# EAGLE design board (EAGLE 6.4)
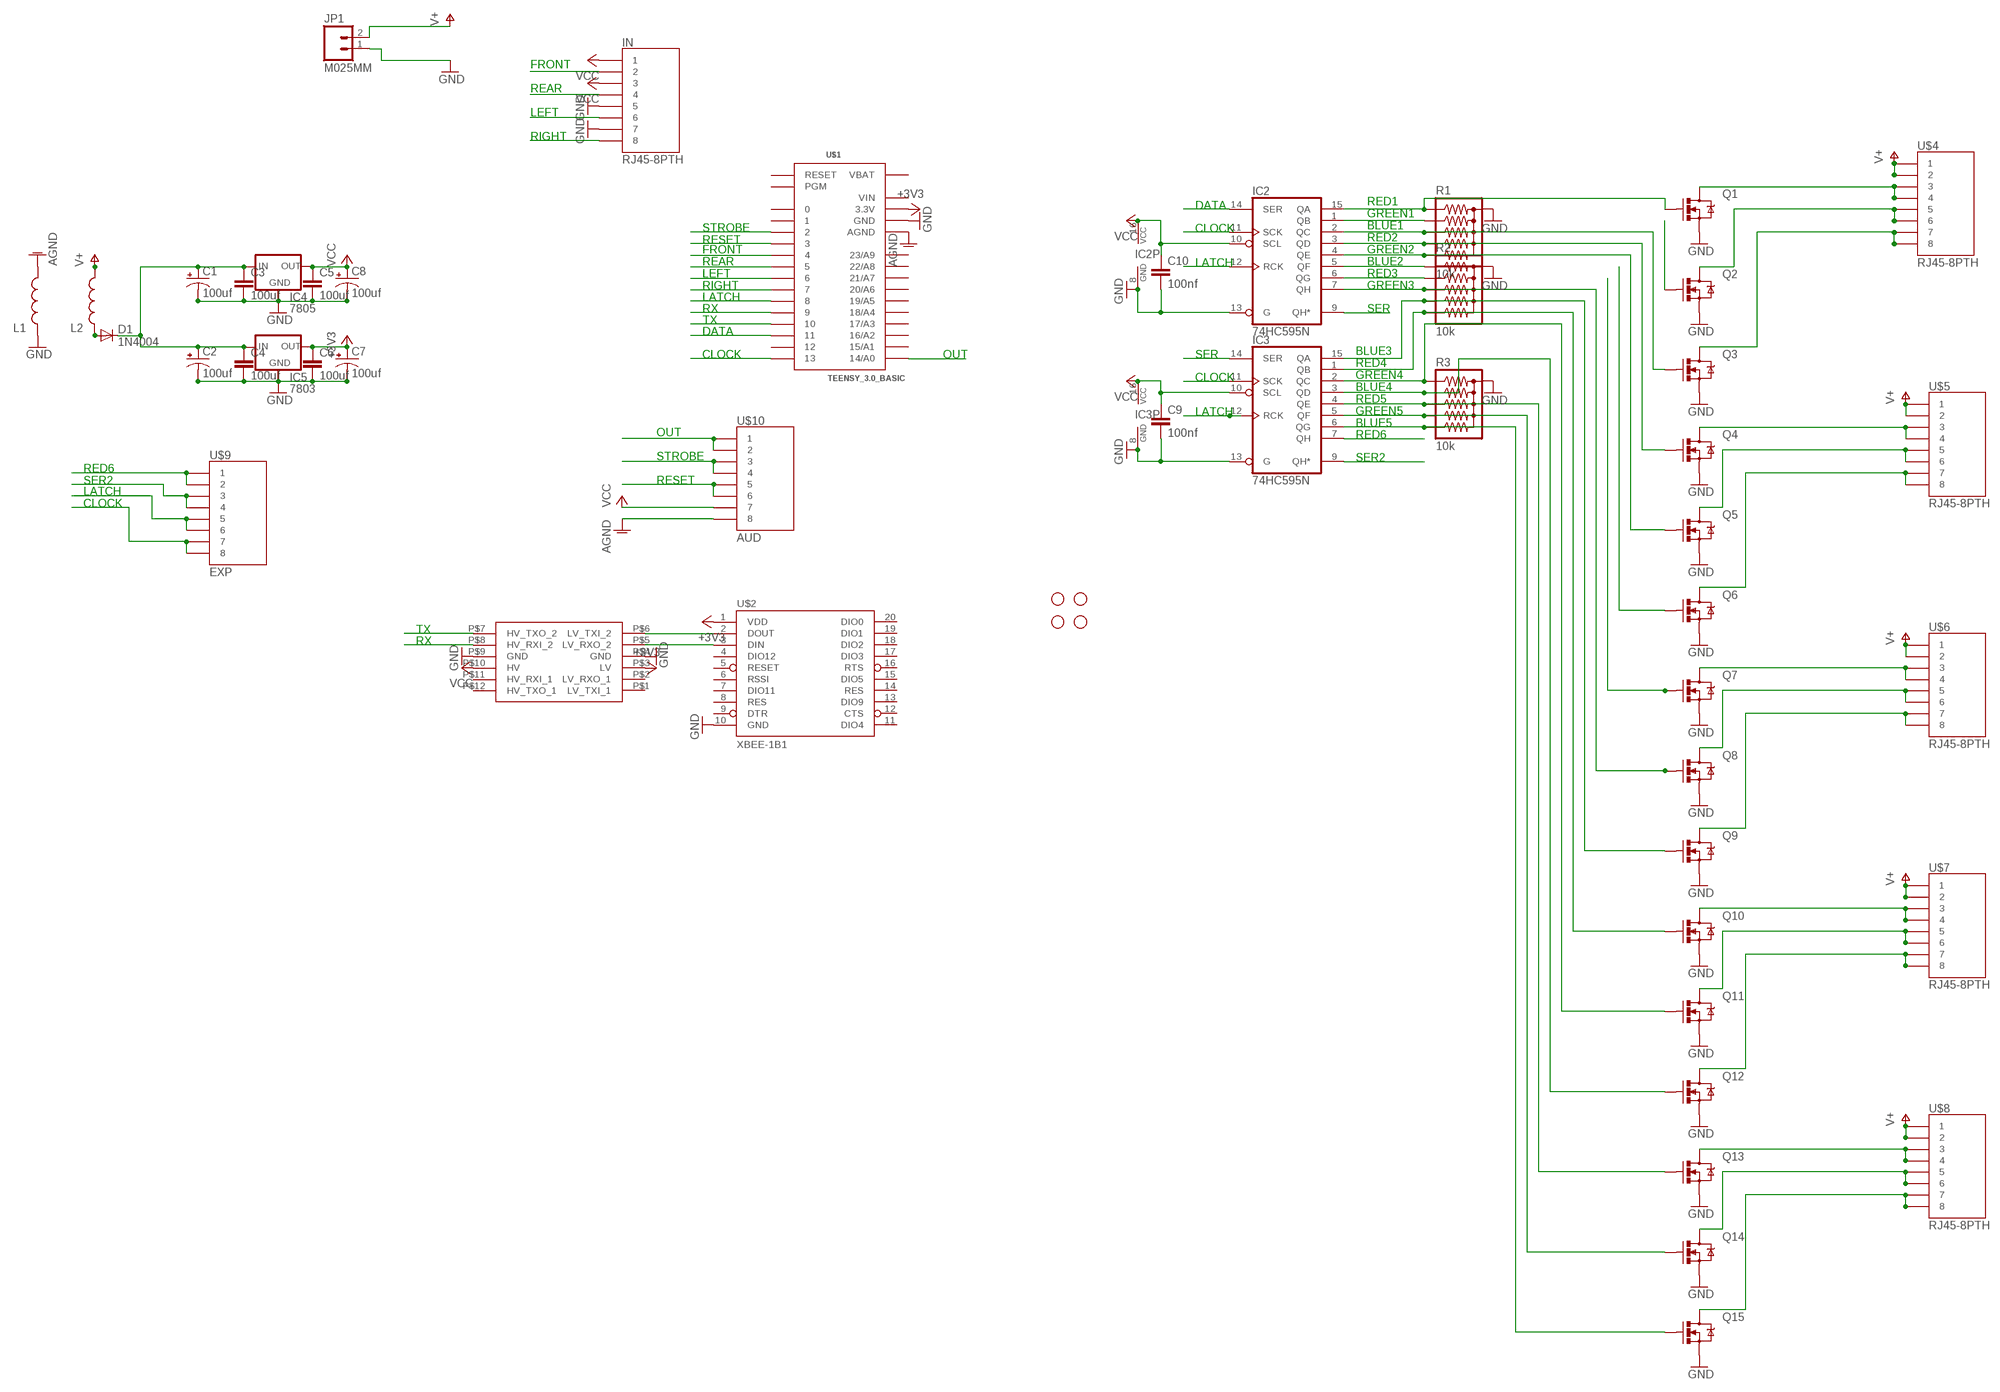
[diagram p0: schematic, sheet 1]

## Parts
C1  100uf  CAP_POLPTH1  [CPOL-RADIAL-100UF-25V]
C2  100uf  CAP_POLPTH1  [CPOL-RADIAL-100UF-25V]
C3  100uf  CAPPTH  [CAP-PTH-SMALL]
C4  100uf  CAPPTH  [CAP-PTH-SMALL]
C5  100uf  CAPPTH  [CAP-PTH-SMALL]
C6  100uf  CAPPTH  [CAP-PTH-SMALL]
C7  100uf  CAP_POLPTH1  [CPOL-RADIAL-100UF-25V]
C8  100uf  CAP_POLPTH1  [CPOL-RADIAL-100UF-25V]
C9  100nf  CAPPTH  [CAP-PTH-SMALL]
C10  100nf  CAPPTH  [CAP-PTH-SMALL]
D1  1N4004  [DO41-10]
IC2  74HC595N  [DIL16]
IC3  74HC595N  [DIL16]
IC4  7805  V_REG_78XXSINK  [TO220-IGO]
IC5  7803  V_REG_LD1117VXX  [78XXL]
IN  RJ45-8PTH  [RJ45-8]
JP1  M025MM  [SCREWTERMINAL-5MM-2]
L1  INDUCTORRLB0912  [RLB0912]
L2  INDUCTORRLB0912  [RLB0912]
Q1  MOSFET-NCHANNELFQP30N06L  [TO220V]
Q2  MOSFET-NCHANNELFQP30N06L  [TO220V]
Q3  MOSFET-NCHANNELFQP30N06L  [TO220V]
Q4  MOSFET-NCHANNELFQP30N06L  [TO220V]
Q5  MOSFET-NCHANNELFQP30N06L  [TO220V]
Q6  MOSFET-NCHANNELFQP30N06L  [TO220V]
Q7  MOSFET-NCHANNELFQP30N06L  [TO220V]
Q8  MOSFET-NCHANNELFQP30N06L  [TO220V]
Q9  MOSFET-NCHANNELFQP30N06L  [TO220V]
Q10  MOSFET-NCHANNELFQP30N06L  [TO220V]
Q11  MOSFET-NCHANNELFQP30N06L  [TO220V]
Q12  MOSFET-NCHANNELFQP30N06L  [TO220V]
Q13  MOSFET-NCHANNELFQP30N06L  [TO220V]
Q14  MOSFET-NCHANNELFQP30N06L  [TO220V]
Q15  MOSFET-NCHANNELFQP30N06L  [TO220V]
R1  10k  RPACK-BUSSED-5-SIP-PTH-5  [RPACK-SIP-PTH-5]
R2  10k  RPACK-BUSSED-5-SIP-PTH-5  [RPACK-SIP-PTH-5]
R3  10k  RPACK-BUSSED-5-SIP-PTH-5  [RPACK-SIP-PTH-5]
STANDOFF1  STAND-OFF  [STAND-OFF]
STANDOFF2  STAND-OFF  [STAND-OFF]
STANDOFF3  STAND-OFF  [STAND-OFF]
STANDOFF4  STAND-OFF  [STAND-OFF]
U$1  TEENSY_3.0_BASIC  [TEENSY_3.0_BASIC]
U$2  XBEE-1B1  [XBEE-1]
U$3  LOGIC_LEVEL_CONVERTER  [LOGIC_LEVEL_CONVERTER]
U$4  RJ45-8PTH  [RJ45-8]
U$5  RJ45-8PTH  [RJ45-8]
U$6  RJ45-8PTH  [RJ45-8]
U$7  RJ45-8PTH  [RJ45-8]
U$8  RJ45-8PTH  [RJ45-8]
U$9  EXP  RJ45-8PTH  [RJ45-8]
U$10  AUD  RJ45-8PTH  [RJ45-8]

## Nets
+3V3: C6.1 C7.1(+) IC5.GND(OUT) U$1.3.3V U$1.3.3V1(3.3V) U$2.1(VDD) U$3.P$3(LV)
AGND: L1.2 U$1.AGND U$10.8
BLUE1: IC2.2(QC) Q3.1(G) R1.P$4
BLUE2: IC2.5(QF) Q6.1(G) R2.P$2
BLUE3: IC3.15(QA) Q9.1(G) R2.P$5
BLUE4: IC3.3(QD) Q12.1(G) R3.P$3
BLUE5: IC3.6(QG) Q15.1(G) R3.P$6
CLOCK: IC2.11(SCK) IC3.11(SCK) U$1.13 U$9.7 U$9.8
DATA: IC2.14(SER) U$1.11
FRONT: IN.2 U$1.4
GND: C1.2(-) C2.2(-) C3.2 C4.2 C5.2 C6.2 C7.2(-) C8.2(-) C9.2 C10.2 IC2.8(GND) IC2.13(G) IC3.8(GND) IC3.13(G) IC4.GND IC5.IN(GND) IN.5 IN.7 JP1.1 L1.1 Q1.3(S) Q2.3(S) Q3.3(S) Q4.3(S) Q5.3(S) Q6.3(S) Q7.3(S) Q8.3(S) Q9.3(S) Q10.3(S) Q11.3(S) Q12.3(S) Q13.3(S) Q14.3(S) Q15.3(S) R1.P$1 R2.P$1 R3.P$1 U$1.GND U$1.GND1(GND) U$2.10(GND) U$3.P$4(GND) U$3.P$9(GND)
GREEN1: IC2.1(QB) Q2.1(G) R1.P$3
GREEN2: IC2.4(QE) Q5.1(G) R1.P$6
GREEN3: IC2.7(QH) Q8.1(G) R2.P$4
GREEN4: IC3.2(QC) Q11.1(G) R3.P$2
GREEN5: IC3.5(QF) Q14.1(G) R3.P$5
LATCH: IC2.12(RCK) IC3.12(RCK) U$1.8 U$9.5 U$9.6
LEFT: IN.6 U$1.6
N$1: Q3.2(D) U$4.7 U$4.8
N$3: D1.A L2.1
N$4: Q4.2(D) U$5.3 U$5.4
N$5: Q5.2(D) U$5.5 U$5.6
N$6: Q6.2(D) U$5.7 U$5.8
N$7: C1.1(+) C2.1(+) C3.1 C4.1 D1.C IC4.IN IC5.OUT(IN)
N$8: Q7.2(D) U$6.3 U$6.4
N$10: Q8.2(D) U$6.5 U$6.6
N$11: Q9.2(D) U$6.7 U$6.8
N$12: Q10.2(D) U$7.3 U$7.4
N$13: Q11.2(D) U$7.5 U$7.6
N$14: Q12.2(D) U$7.7 U$7.8
N$15: Q13.2(D) U$8.3 U$8.4
N$16: Q14.2(D) U$8.5 U$8.6
N$17: Q15.2(D) U$8.7 U$8.8
N$19: Q1.2(D) U$4.3 U$4.4
N$20: Q2.2(D) U$4.5 U$4.6
N$28: U$2.3(DIN) U$3.P$5(LV_RXO_2)
N$29: U$2.2(DOUT) U$3.P$6(LV_TXI_2)
OUT: U$1.14/A0 U$10.1 U$10.2
REAR: IN.4 U$1.5
RED1: IC2.15(QA) Q1.1(G) R1.P$2
RED2: IC2.3(QD) Q4.1(G) R1.P$5
RED3: IC2.6(QG) Q7.1(G) R2.P$3
RED4: IC3.1(QB) Q10.1(G) R2.P$6
RED5: IC3.4(QE) Q13.1(G) R3.P$4
RED6: IC3.7(QH) U$9.1 U$9.2
RESET: U$1.3 U$10.5 U$10.6
RIGHT: IN.8 U$1.7
RX: U$1.9 U$3.P$7(HV_TXO_2)
SER: IC2.9(QH*) IC3.14(SER)
SER2: IC3.9(QH*) U$9.3 U$9.4
STROBE: U$1.2 U$10.3 U$10.4
TX: U$1.10 U$3.P$8(HV_RXI_2)
V+: JP1.2 L2.2 U$4.1 U$4.2 U$5.1 U$5.2 U$6.1 U$6.2 U$7.1 U$7.2 U$8.1 U$8.2
VCC: C5.1 C8.1(+) C9.1 C10.1 IC2.10(SCL) IC2.16(VCC) IC3.10(SCL) IC3.16(VCC) IC4.OUT IN.1 IN.3 U$3.P$10(HV) U$10.7
Unconnected: U$1.0 U$1.1 U$1.12 U$1.15/A1 U$1.16/A2 U$1.17/A3 U$1.18/A4 U$1.19/A5 U$1.20/A6 U$1.21/A7 U$1.22/A8 U$1.23/A9 U$1.PGM U$1.RESET U$2.4(DIO12) U$2.5(RESET) U$2.6(RSSI) U$2.7(DIO11) U$2.8(RES) U$2.9(DTR) U$2.11(DIO4) U$2.12(CTS) U$2.13(DIO9) U$2.14(RES) U$2.15(DIO5) U$2.16(RTS) U$2.17(DIO3) U$2.18(DIO2) U$2.19(DIO1) U$2.20(DIO0) U$3.P$1(LV_TXI_1) U$3.P$2(LV_RXO_1) U$3.P$11(HV_RXI_1) U$3.P$12(HV_TXO_1)

## Notes on the sheet
- FRONT
  
  REAR
  
  LEFT
  
  RIGHT
- DATA
- CLOCK
- STROBE
  RESET
- LATCH
- FRONT
  REAR
  LEFT
  RIGHT
- RED1
  GREEN1
  BLUE1
  RED2
  GREEN2
  BLUE2
  RED3
  GREEN3
- LATCH
- RX | SER
- TX
- DATA
- CLOCK | OUT | SER
- CLOCK
- LATCH
- BLUE3
  RED4
  GREEN4
  BLUE4
  RED5
  GREEN5
  BLUE5
- RED6
- SER2
- RED6
  SER2
- OUT
  
  STROBE
  
  RESET
- LATCH
  CLOCK
- TX
- RX

## Power pins joined to a net without a drawn wire
VBAT: U$1.VBAT
VIN: U$1.VIN

## Library data of the parts
C1 C2 C7 C8 = SparkFun-Capacitors:CAP_POL: Capacitor Polarized These are standard SMD and PTH capacitors. Normally 10uF, 47uF, and 100uF in electrolytic and tantalum varieties. Always verify the external diameter of the through hole cap, it varies with capacity, voltage, and manufacturer. The EIA devices should be standard.
C3-C6 C9 C10 = SparkFun-Capacitors:CAP: Capacitor Standard 0603 ceramic capacitor, and 0.1" leaded capacitor.
D1 = diode:1N4004: DIODE general purpose rectifier, 1 A
IC2 IC3 = 74xx-eu:74*595: 8-bit SHIFT REGISTER, output latch
IC4 = SparkFun-PowerIC:V_REG_78XX: Voltage Regulator Standard 7805 5V regulator. IGO (Input Ground Output). Spark Fun Electronics SKU : COM-00107
IC5 = SparkFun-PowerIC:V_REG_LD1117VXX: LD1117VXX voltage regulator. We carry the 3.3V version (COM-00526) in TO-220 package.
IN U$4-U$10 = SparkFun-Connectors:RJ45-8: RJ45 Jack Simple RJ45, 8-pin connection - connector for common Cat5, Cat5e, and Cat6 Ethernet cables. Footprint not yet proven in production. Connector sku is PRT-00643; Breakout PCB sku is BOB-00716.
JP1 = SparkFun-Connectors:M02: Standard 2-pin 0.1" header. Use with - straight break away headers ( PRT-00116) - right angle break away headers (PRT-00553) - swiss pins (PRT-00743) - machine pins (PRT-00117) - female headers (PRT-00115) Molex polarized connector foot print use with: PRT-08233 with associated crimp pins and housings. 2.54_SCREWTERM for use with PRT-10571. 3.5mm Screw Terminal footprints for PRT-08084 5mm Screw Terminal footprints for use with PRT-08433
L1 L2 = SparkFun-Passives:INDUCTOR: Inductors Basic Inductor/Choke - 0603 and 1206. Footprints are not proven and vary greatly between part numbers. SRN6045- 33uH, 20% 1.4A SDR0403-560KL - 56uH, 10%, 500mA RMS/740mA peak
Q1-Q15 = SparkFun-DiscreteSemi:MOSFET-NCHANNEL: Common NMOSFET Parts MFG P/N Store ID Prod ID FDD8780 TRANS-09984 SI7820DN TRANS-11055 FDS6630A IC-08089 2N7002PW TRANS-11151 FQP30N06L COM-10213 TRANS-10060 BSS123LT1G TRANS-08345 BSS138 TRANS-00830 BS170 2N7000; PROD_ID: TRANS-10060
R1-R3 = SparkFun-Resistors:RPACK-BUSSED-5: BOURNS 4600X series thick-film SIP resistor packs Five resistors bussed to a single pin (denoted by dot). 0.2W / resistor datasheet <http://dlnmh9ip6v2uc.cloudfront.net/datasheets/Components/General/4600x.pdf> SFE parts COM-10855 (330), COM-10856 (10K)
STANDOFF1-STANDOFF4 = SparkFun-Electromechanical:STAND-OFF: #4 Stand Off This is the mechanical footprint for a #4 phillips button head screw. Use the keepout ring to avoid running the screw head into surrounding components. SKU : PRT-00447
U$1 = Teensy3.0:TEENSY_3.0_BASIC: Basic Teensy 3.0 with none of the 'inner' pins enabled. See '+4', 'AllAnalogPins", and 'AllPins' packages for additional pin holes, as needed.
U$2 = SparkFun-RF:XBEE-1: Xbee module footprints SMT header is CONN-09042.
U$3 = SparkFun-Boards:LOGIC_LEVEL_CONVERTER: Logic Level Converter (3.3v - 5v) https://www.sparkfun.com/products/8745

## Board
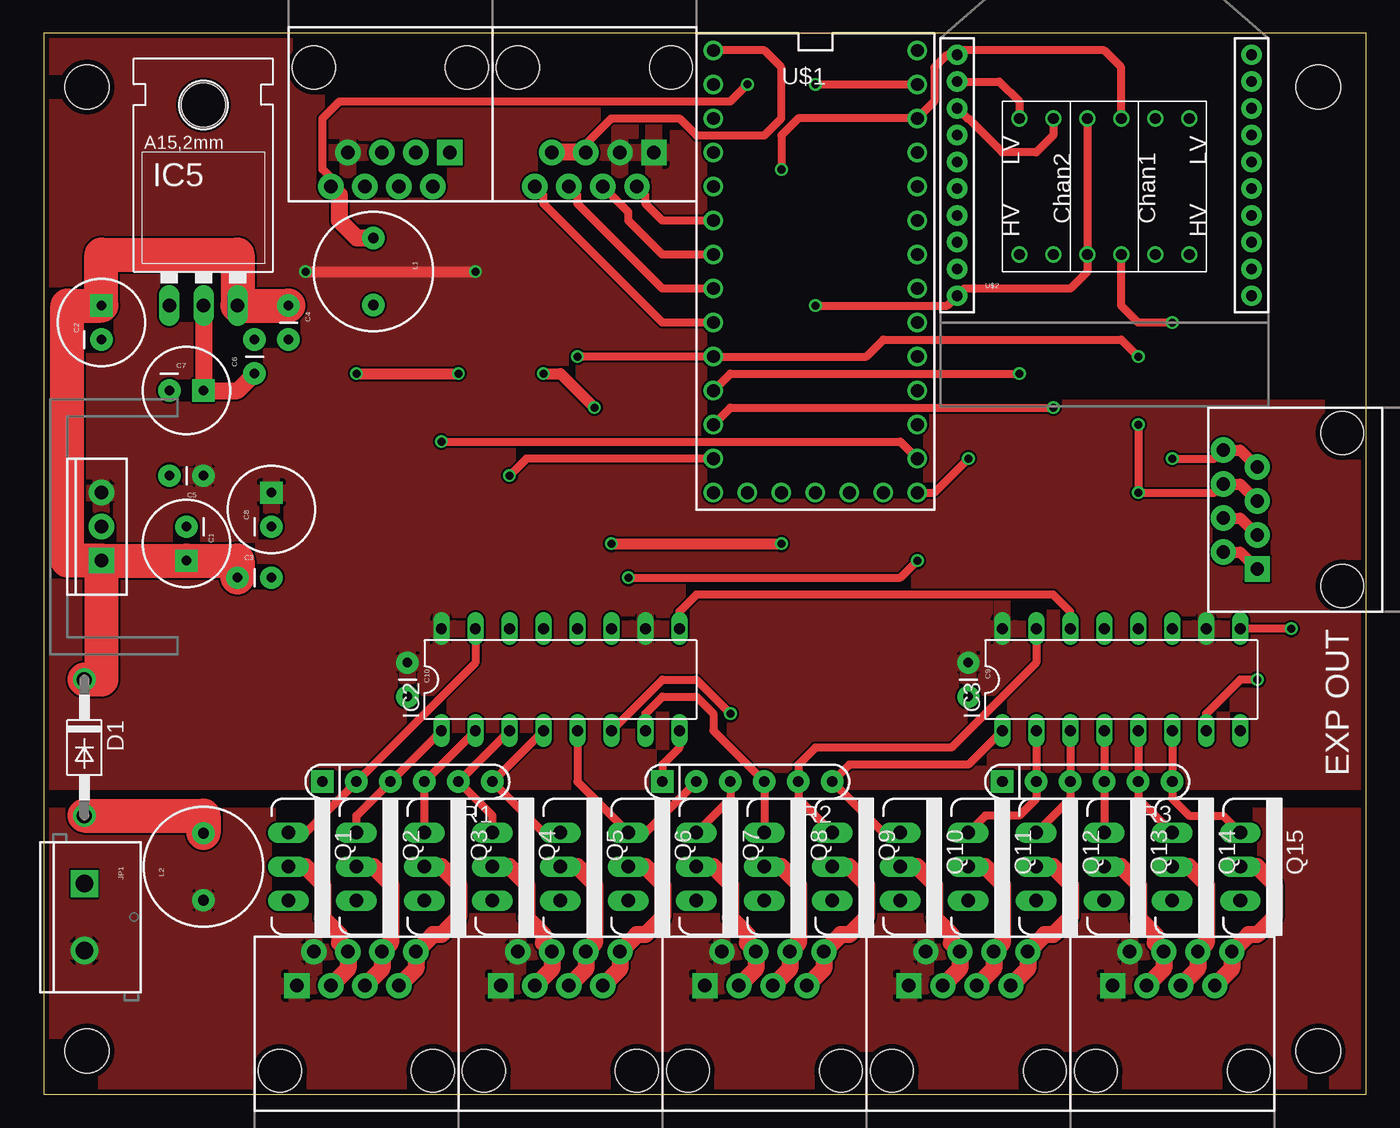
[diagram p1: board, top side]
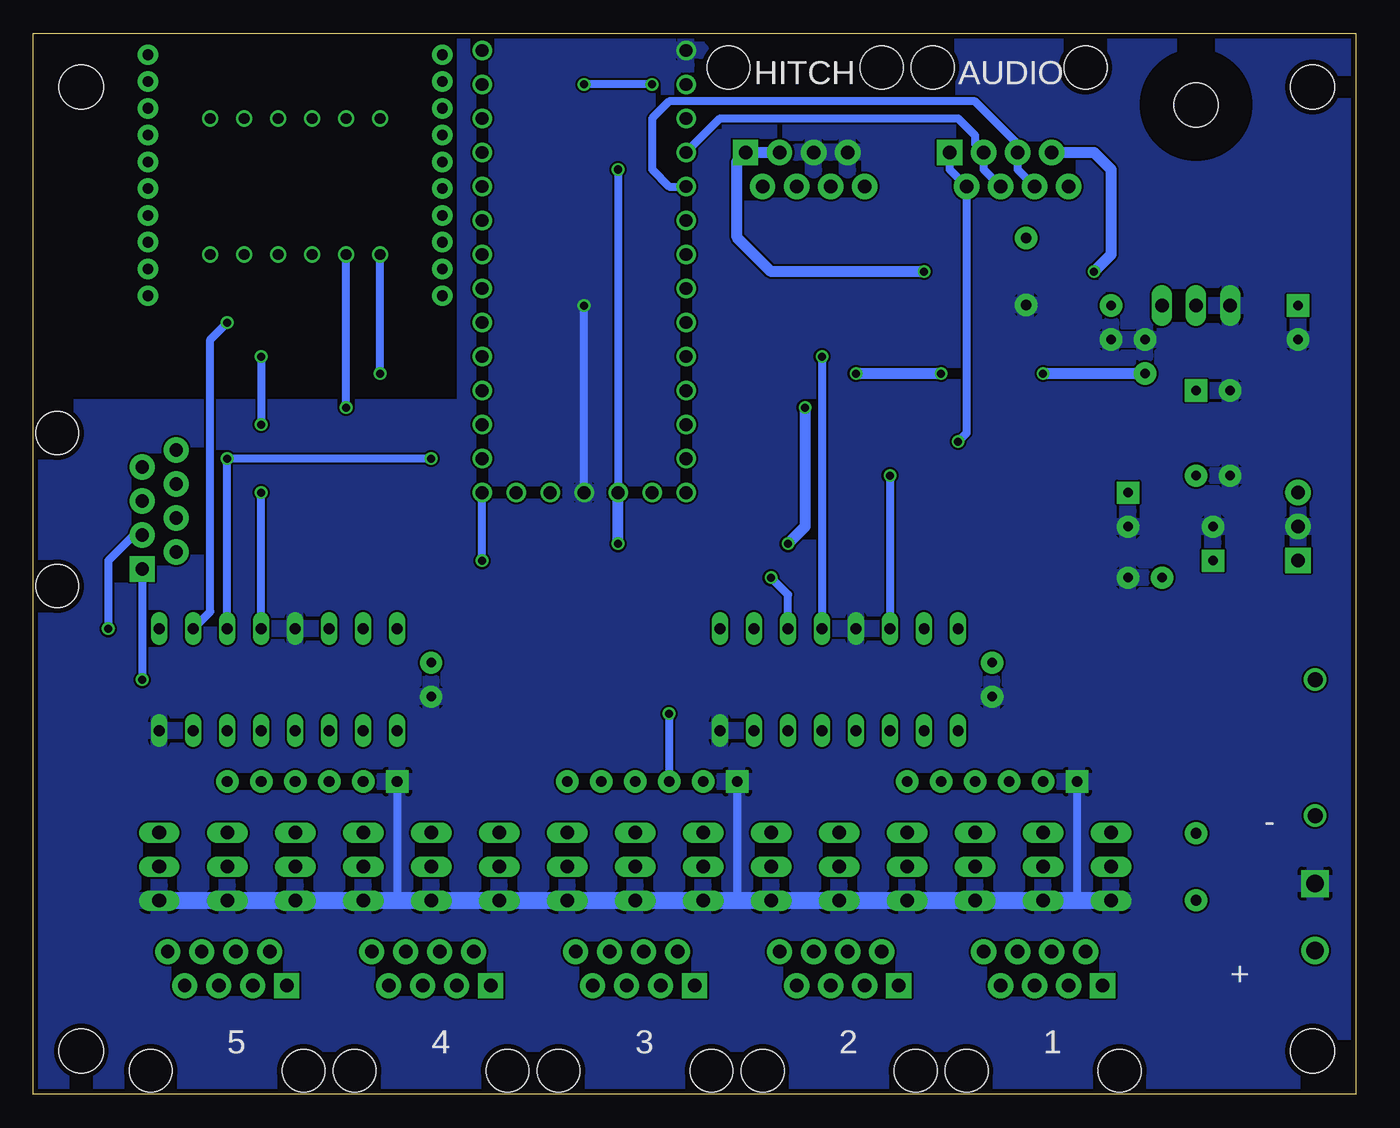
[diagram p2: board, bottom side, seen from below]

Size 98.81 x 79.25 mm. Coordinates in mm from the lower left corner, seen from the top.
Outline: 0,0 98.81,0 98.81,79.25 0,79.25 0,0
Copper layers (1*16): Top 0.0356mm / dielectric 1.5011mm / Bottom 0.0356mm
Design rules "oshpark": minimum track width 6mil, minimum drill 13mil, track to track 6mil, track to pad 6mil, pad to pad 6mil, via to via 6mil, smd to smd 6mil, copper to edge 15mil, drill to drill 6mil, minimum pad ring 7mil, minimum via ring 7mil, stop-mask expansion 3mil, vias tented up to drill 0mil, thermal gap 10mil

### Footprints (pad centres in the part's own frame; a part is rotated, then mirrored left to right if it is on the bottom)
CPOL-RADIAL-100UF-25V = drill 0.7 pad 1.651 square: 1 1.27,0 | drill 0.7 pad 1.651: 2 -1.27,0
CAP-PTH-SMALL = drill 0.7 pad 1.651: 1 0,0; 2 2.54,0
DO41-10 = drill 1.118: A 5.08,0; C -5.08,0
DIL16 = drill 0.813 long: 1 -8.89,-3.81; 2 -6.35,-3.81; 3 -3.81,-3.81; 4 -1.27,-3.81; 5 1.27,-3.81; 6 3.81,-3.81; 7 6.35,-3.81; 8 8.89,-3.81; 9 8.89,3.81; 10 6.35,3.81; 11 3.81,3.81; 12 1.27,3.81; 13 -1.27,3.81; 14 -3.81,3.81; 15 -6.35,3.81; 16 -8.89,3.81
TO220-IGO = drill 1 pad 1.88: GND 0,0; OUT 2.54,0 | drill 1 pad 1.88 square: IN -2.54,0
78XXL = drill 1.016 long: GND 0,-3.81; IN -2.54,-3.81; OUT 2.54,-3.81 | hole 3.302: 0,11.176
RJ45-8 = drill 1 pad 1.88 square: 1 -4.445,6.35 | drill 1 pad 1.88: 2 -3.175,8.89; 3 -1.905,6.35; 4 -0.635,8.89; 5 0.635,6.35; 6 1.905,8.89; 7 3.175,6.35; 8 4.445,8.89 | hole 3.2: -5.715,0; 5.715,0
SCREWTERMINAL-5MM-2 = drill 1.3 pad 2.032 square: 1 0,0 | drill 1.3 pad 2.032: 2 5,0
RLB0912 = drill 0.813 pad 1.651: 1 2.502,0; 2 -2.502,0
TO220V = drill 1.016 long: 1 -2.54,0; 2 0,0; 3 2.54,0
RPACK-SIP-PTH-5 = drill 0.8 pad 1.676 square: P$1 0,0 | drill 0.8 pad 1.676: P$2 0,-2.54; P$3 0,-5.08; P$4 0,-7.62; P$5 0,-10.16; P$6 0,-12.7
STAND-OFF = hole 3.302: 0,0
TEENSY_3.0_BASIC = drill 0.965: 0 -7.62,13.97; 1 -7.62,11.43; 2 -7.62,8.89; 3 -7.62,6.35; 3.3V 7.62,11.43; 3.3V1 -2.54,-16.51; 4 -7.62,3.81; 5 -7.62,1.27; 6 -7.62,-1.27; 7 -7.62,-3.81; 8 -7.62,-6.35; 9 -7.62,-8.89; 10 -7.62,-11.43; 11 -7.62,-13.97; 12 -7.62,-16.51; 13 7.62,-16.51; 14/A0 7.62,-13.97; 15/A1 7.62,-11.43; 16/A2 7.62,-8.89; 17/A3 7.62,-6.35; 18/A4 7.62,-3.81; 19/A5 7.62,-1.27; 20/A6 7.62,1.27; 21/A7 7.62,3.81; 22/A8 7.62,6.35; 23/A9 7.62,8.89; AGND 7.62,13.97; GND -7.62,16.51; GND1 0,-16.51; PGM 2.54,-16.51; RESET 5.08,-16.51; VBAT -5.08,-16.51; VIN 7.62,16.51
XBEE-1 = drill 0.8 pad 1.524: 1 -11,20; 2 -11,18; 3 -11,16; 4 -11,14; 5 -11,12; 6 -11,10; 7 -11,8; 8 -11,6; 9 -11,4; 10 -11,2; 11 11,2; 12 11,4; 13 11,6; 14 11,8; 15 11,10; 16 11,12; 17 11,14; 18 11,16; 19 11,18; 20 11,20
LOGIC_LEVEL_CONVERTER = drill 0.8: P$1 1.27,13.97; P$2 1.27,11.43; P$3 1.27,8.89; P$4 1.27,6.35; P$5 1.27,3.81; P$6 1.27,1.27; P$7 11.43,1.27; P$8 11.43,3.81; P$9 11.43,6.35; P$10 11.43,8.89; P$11 11.43,11.43; P$12 11.43,13.97

### Placement (x,y rotation side)
C1  10.67,41.15 270 top
C2  4.32,57.66 90 top
C3  14.48,38.61 0 top
C4  18.29,58.93 270 top
C5  11.94,46.23 180 top
C6  15.75,53.85 90 top
C7  10.67,52.58 0 top
C8  17.02,43.69 90 top
C9  69.09,32.26 270 top
C10  27.18,32.26 270 top
D1  3.05,25.91 270 top
IC2  38.61,30.99 0 top
IC3  80.52,30.99 0 top
IC4  4.32,42.42 90 top
IC5  11.94,62.74 0 top
IN  41.15,76.71 180 top
JP1  3.05,15.75 270 top
L1  24.64,61.47 270 top
L2  11.94,17.02 90 top
Q1  18.29,17.02 270 top
Q2  23.37,17.02 270 top
Q3  28.45,17.02 270 top
Q4  33.53,17.02 270 top
Q5  38.61,17.02 270 top
Q6  43.69,17.02 270 top
Q7  48.77,17.02 270 top
Q8  53.85,17.02 270 top
Q9  58.93,17.02 270 top
Q10  64.01,17.02 270 top
Q11  69.09,17.02 270 top
Q12  74.17,17.02 270 top
Q13  79.25,17.02 270 top
Q14  84.33,17.02 270 top
Q15  89.41,17.02 270 top
R1  20.83,23.37 90 top
R2  46.23,23.37 90 top
R3  71.63,23.37 90 top
STANDOFF1  3.24,3.24 0 top
STANDOFF2  95.24,3.24 0 top
STANDOFF3  95.24,75.23 0 top
STANDOFF4  3.24,75.23 0 top
U$1  57.66,61.47 0 top
U$2  79.25,57.66 0 top
U$3  71.63,74.17 270 top
U$4  23.37,1.78 0 top
U$5  38.61,1.78 0 top
U$6  53.85,1.78 0 top
U$7  69.09,1.78 0 top
U$8  84.33,1.78 0 top
U$9  97.03,43.69 90 top
U$10  25.91,76.71 180 top

### Tracks (layer width: path | path; a pad name or v marks a point on that pad's centre or on a via)
+3V3  (via drill 0.6)
  Top 0.61: U$3.P$3 80.52,76.71 79.25,77.98 68.57,77.98 U$2.1 67.5,77.66 66.55,76.71 66.55,74.17 U$1.3.3V 56.39,72.9 55.12,71.63 v55.12,69.09
  Top 0.813: v23.37,53.85 v30.99,53.85 | v37.34,53.85 38.61,53.85 v41.15,51.31 | v42.42,41.15 v55.12,41.15
  Top 1.27: IC5.GND C7.1 14.48,52.58 C6.1
  Bottom 0.61: v55.12,69.09 U$1.3.3V1
  Bottom 0.813: C6.1 v23.37,53.85 | v30.99,53.85 v37.34,53.85 | v41.15,51.31 41.15,42.42 v42.42,41.15 | v55.12,41.15 U$1.3.3V1
AGND  (via drill 0.6)
  Top 0.61: L1.2 24.64,64.01 23.37,64.01 | 22.1,65.28 22.1,67.82 20.83,69.09 20.83,72.9 22.1,74.17 51.31,74.17 v52.58,75.44 | v57.66,75.44 U$1.AGND
  Top 1.27: L1.2 23.41,63.97 23.37,64.01 22.1,65.28 22.1,67.18 U$10.8
  Bottom 0.61: v52.58,75.44 v57.66,75.44
BLUE1
  Top 0.61: Q3.1 R1.P$4 IC2.2
BLUE2
  Top 0.61: R2.P$2 44.96,19.56 Q6.1 39.88,23.37 IC2.5
BLUE3
  Top 0.61: Q9.1 56.39,22.1 R2.P$5 56.39,24.64 57.66,25.91 67.82,25.91 74.17,32.26 IC3.15
BLUE4
  Top 0.61: IC3.3 R3.P$3 76.71,22.1 Q12.1
BLUE5
  Top 0.61: IC3.6 R3.P$6 84.33,22.1 85.6,20.83 88.14,20.83 Q15.1
CLOCK  (via drill 0.6)
  Top 0.61: v84.33,47.5 87.5,47.5 U$9.8 | v43.69,38.61 64.01,38.61 v65.28,39.88 | U$1.13 66.55,44.96 v69.09,47.5
  Top 0.813: U$9.8 89.41,48.13 U$9.7
  Bottom 0.61: IC3.11 v84.33,47.5 v69.09,47.5 | IC2.11 42.42,37.34 v43.69,38.61 | v65.28,39.88 U$1.13
DATA  (via drill 0.6)
  Top 0.61: U$1.11 36.07,47.5 v34.8,46.23
  Bottom 0.61: v34.8,46.23 IC2.14
FRONT
  Top 0.61: U$1.4 46.23,65.28 44.96,66.55 44.96,67.18 IN.2
GND  (via drill 0.6)
  Top 0.61: IC2.8 47.5,25.91 46.23,24.64 R2.P$1 | IN.5 40.51,70.99 42.42,72.9 47.5,72.9 48.77,71.63 53.85,71.63 55.12,72.9 55.12,76.71 53.85,77.98 U$1.GND | U$3.P$4 U$3.P$9 77.98,61.47 76.71,60.2 68.79,60.2 U$2.10 67.52,58.93 v57.66,58.93
  Top 1.27: IN.5 IN.7
  Bottom 0.61: R2.P$1 46.23,14.48 | R3.P$1 71.63,14.48 | R1.P$1 20.83,14.48 | U$1.GND1 v57.66,58.93
  Bottom 1.27: Q1.3 20.83,14.48 Q2.3 Q3.3 Q4.3 Q5.3 Q6.3 46.23,14.48 Q7.3 Q8.3 Q9.3 Q10.3 Q11.3 71.63,14.48 Q12.3 Q13.3 Q14.3 Q15.3
  pour Bottom: -0.76,80.52 66.55,80.52 66.55,77.98 66.55,51.31 99.57,51.31 99.57,-0.76 -0.76,-0.76
GREEN1
  Top 0.61: Q2.1 23.37,20.83 R1.P$3 IC2.1
GREEN2
  Top 0.61: Q5.1 37.34,19.56 R1.P$6 IC2.4
GREEN3
  Top 0.61: Q8.1 R2.P$4 50.04,27.18 50.04,28.45 48.77,29.72 46.23,29.72 44.96,28.45 IC2.7
GREEN4
  Top 0.61: IC3.2 R3.P$2 74.17,22.1 72.9,20.83 70.36,20.83 Q11.1
GREEN5
  Top 0.61: IC3.5 R3.P$5 81.79,22.1 Q14.1
LATCH  (via drill 0.6)
  Top 0.61: U$9.6 87.5,44.96 v81.79,44.96 v81.79,50.04 | v81.79,55.12 80.52,56.39 62.74,56.39 61.47,55.12 U$1.8 v39.88,55.12
  Top 0.813: U$9.6 89.41,45.59 U$9.5
  Bottom 0.61: IC3.12 v81.79,44.96 | v81.79,55.12 v81.79,50.04 | v39.88,55.12 IC2.12
LEFT
  Top 0.61: U$1.6 46.23,60.2 39.88,66.55 39.88,67.18 IN.6
N$1
  Top 1.27: Q3.2 29.72,17.02 30.99,15.75 30.99,13.21 29.72,11.94 29.08,11.94 U$4.8 27.81,9.4 U$4.7
N$3
  Top 2.54: D1.A 11.94,20.83 L2.1
N$4
  Top 1.27: Q4.2 34.8,17.02 36.07,15.75 36.07,13.21 37.34,11.94 37.34,11.3 U$5.4 37.97,9.4 U$5.3
N$5
  Top 1.27: Q5.2 39.88,17.02 41.15,15.75 41.15,11.3 U$5.6 40.51,9.4 U$5.5
N$6
  Top 1.27: U$5.7 43.05,9.4 U$5.8 44.32,11.94 44.96,11.94 46.23,13.21 46.23,15.75 44.96,17.02 Q6.2
N$7
  Top 2.54: IC4.IN C1.1 14.48,39.88 C3.1 | IC4.IN 1.78,39.88 1.78,58.93 C2.1 4.32,62.74 14.48,62.74 IC5.OUT C4.1 | IC4.IN 4.32,30.99 D1.C
N$8
  Top 1.27: Q7.2 50.04,17.02 51.31,15.75 51.31,13.21 52.58,11.94 52.58,11.3 U$6.4 53.21,9.4 U$6.3
N$10
  Top 1.27: Q8.2 55.12,17.02 56.39,15.75 56.39,11.3 U$6.6 55.75,9.4 U$6.5
N$11
  Top 1.27: Q9.2 60.2,17.02 61.47,15.75 61.47,13.21 60.2,11.94 59.56,11.94 U$6.8 58.29,9.4 U$6.7
N$12
  Top 1.27: Q10.2 65.28,17.02 66.55,15.75 66.55,13.21 67.82,11.94 67.82,11.3 U$7.4 68.45,9.4 U$7.3
N$13
  Top 1.27: Q11.2 70.36,17.02 71.63,15.75 71.63,11.3 U$7.6 70.99,9.4 U$7.5
N$14
  Top 1.27: Q12.2 75.44,17.02 76.71,15.75 76.71,13.21 75.44,11.94 74.8,11.94 U$7.8 73.53,9.4 U$7.7
N$15
  Top 1.27: Q13.2 80.52,17.02 81.79,15.75 81.79,13.21 83.06,11.94 83.06,11.3 U$8.4 83.69,9.4 U$8.3
N$16
  Top 1.27: Q14.2 85.6,17.02 86.87,15.75 86.87,11.3 U$8.6 86.23,9.4 U$8.5
N$17
  Top 1.27: Q15.2 90.68,17.02 91.95,15.75 91.95,13.21 90.68,11.94 90.04,11.94 U$8.8 88.77,9.4 U$8.7
N$19
  Top 1.27: Q1.2 19.56,17.02 20.83,15.75 20.83,13.21 22.1,11.94 22.1,11.3 U$4.4 22.73,9.4 U$4.3
N$20
  Top 1.27: Q2.2 24.64,17.02 25.91,15.75 25.91,11.3 U$4.6 25.27,9.4 U$4.5
N$28
  Top 0.61: U$3.P$5 75.44,71.63 74.17,70.36 71.63,70.36 69.09,72.9 69.01,72.9 U$2.3
N$29
  Top 0.61: U$2.2 71.41,75.66 72.9,74.17 U$3.P$6
OUT  (via drill 0.6)
  Top 0.61: v29.72,48.77 64.01,48.77 U$1.14/A0
  Bottom 0.61: U$10.1 30.35,69.09 U$10.2 29.08,49.4 v29.72,48.77
REAR
  Top 0.61: U$1.5 46.23,62.74 43.69,65.28 43.69,65.91 IN.4
RED1
  Top 0.61: Q1.1 19.56,19.56 R1.P$2 32.26,32.26 IC2.15
RED2
  Top 0.61: Q4.1 33.53,20.83 R1.P$5 IC2.3
RED3  (via drill 0.6)
  Top 0.61: R2.P$3 51.31,22.1 Q7.1 | IC2.6 46.23,30.99 48.77,30.99 v51.31,28.45
  Bottom 0.61: v51.31,28.45 R2.P$3
RED4
  Top 0.61: Q10.1 62.74,19.56 R2.P$6 60.2,24.64 69.09,24.64 IC3.1
RED5
  Top 0.61: IC3.4 R3.P$4 Q13.1
RED6  (via drill 0.6)
  Top 0.61: v90.68,30.99 89.41,30.99 86.87,28.45 IC3.7
  Top 0.813: U$9.2 89.41,40.51 U$9.1
  Bottom 0.61: U$9.1 v90.68,30.99
RESET
  Bottom 0.61: U$10.6 25.27,69.09 U$10.5 25.27,70.99 28.45,74.17 51.31,74.17 52.58,72.9 52.58,69.09 51.31,67.82 U$1.3
RIGHT
  Top 0.61: U$1.7 46.23,57.66 37.34,66.55 37.34,67.18 IN.8
RX  (via drill 0.6)
  Top 0.61: U$1.9 51.31,53.85 v72.9,53.85
  Bottom 0.61: v72.9,53.85 U$3.P$7
SER
  Top 0.61: IC3.14 76.71,36.07 75.44,37.34 48.77,37.34 47.5,36.07 IC2.9
SER2  (via drill 0.6)
  Top 0.61: v93.22,34.8 IC3.9
  Top 0.813: U$9.4 89.41,43.05 U$9.3
  Bottom 0.61: U$9.3 91.31,41.78 93.22,39.88 v93.22,34.8
STROBE
  Bottom 0.61: U$1.2 47.5,72.9 29.72,72.9 28.45,71.63 28.45,70.99 U$10.3 27.81,69.09 U$10.4
TX  (via drill 0.6)
  Top 0.61: U$1.10 51.31,51.31 v75.44,51.31
  Bottom 0.61: v75.44,51.31 U$3.P$8
V+
  pour Top: -0.76,20.83 99.57,20.83 99.57,-0.76 -0.76,-0.76
VCC  (via drill 0.6)
  Top 0.61: v84.33,57.66 81.79,57.66 80.52,58.93 U$3.P$10
  Top 0.813: v19.56,61.47 v32.26,61.47
  Bottom 0.61: IC3.10 85.6,36.07 85.6,56.39 v84.33,57.66
  Bottom 0.813: U$10.7 19.56,70.36 18.29,69.09 18.29,62.74 v19.56,61.47 | v32.26,61.47 43.69,61.47 46.23,64.01 46.23,69.72 IN.1 IN.3
  pour Top: -0.76,80.52 66.55,80.52 66.55,51.31 99.57,51.31 99.57,23.37 -0.76,23.37

### Text on the board
tNames: EXP OUT
bNames: AUDIO | HITCH | - | + | 1 | 2 | 3 | 4 | 5